# EAGLE schematic ecgdesign (EAGLE 9.2.1)
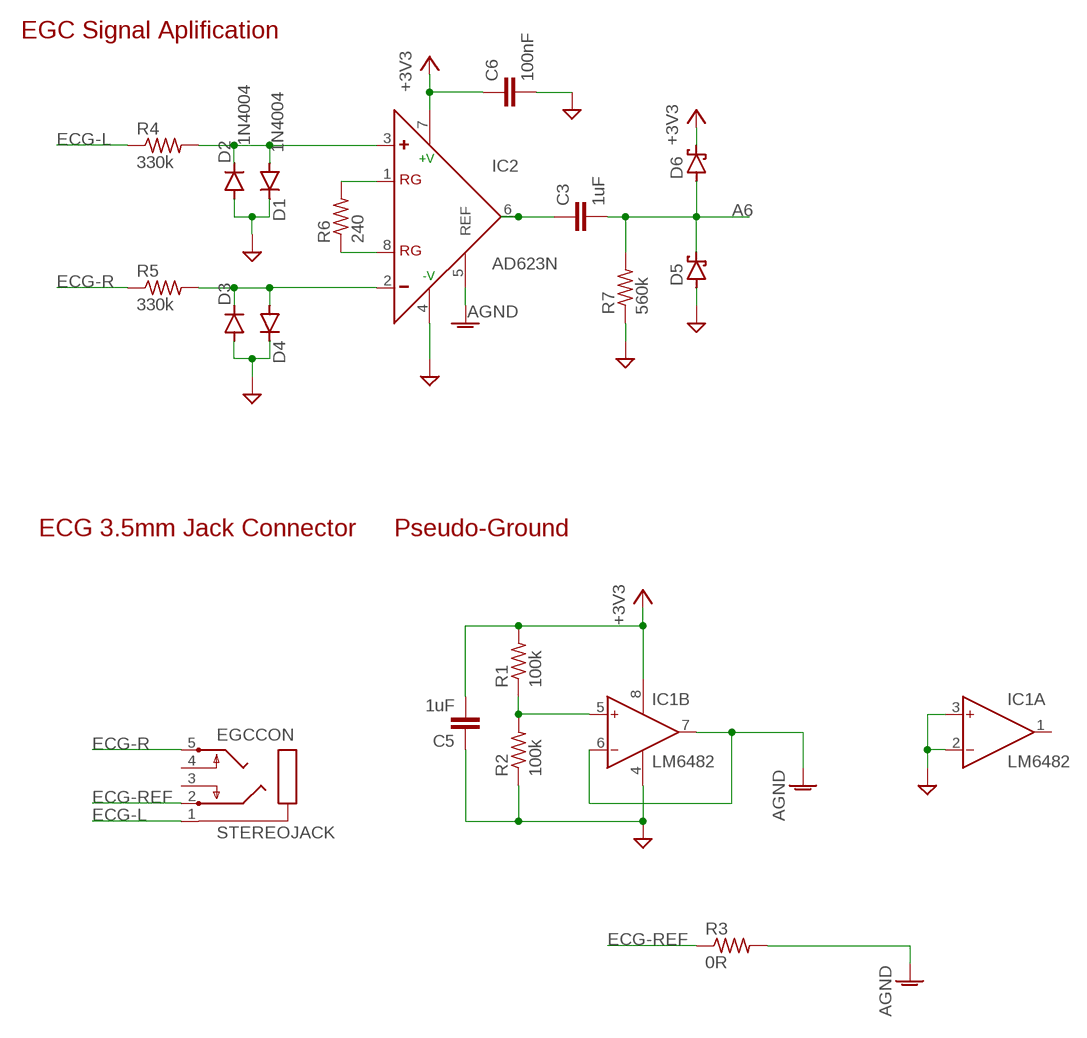
[diagram p0: schematic, sheet 1]

## Parts
C3  1uF  C-EUC0603  [C0603]
C5  1uF  C-EUC0603  [C0603]
C6  100nF  C-EUC0603  [C0603]
D1  1N4004  [DO41-10]
D2  1N4004  [DO41-10]
D3  1N4004  [DO41-10]
D4  1N4004  [DO41-10]
D5  SCHOTTKY-DIODEDO35-7  [DO35-7]
D6  SCHOTTKY-DIODEDO35-7  [DO35-7]
EGCCON  STEREOJACK  [STX3100]
IC1  LM6482  AD826N  [DIL08]
IC2  AD623N  [DIL08]
R1  100k  R-US_R0603  [R0603]
R2  100k  R-US_R0603  [R0603]
R3  0R  R-US_R0603  [R0603]
R4  330k  R-US_R0603  [R0603]
R5  330k  R-US_R0603  [R0603]
R6  240  R-US_R0603  [R0603]
R7  560k  R-US_R0603  [R0603]

## Nets
+3V3 [POWER]: C5.2 C6.1 D6.C IC1.8(P:V+) IC2.7(+V) R1.2
A6: C3.2 D5.C D6.A R7.2
AGND: IC1.6(B:IN-) IC1.7(B:OUT) IC2.5(REF) R3.2
ECG-L: EGCCON.1 R4.1
ECG-R: EGCCON.5 R5.1
ECG-REF: EGCCON.2 R3.1
GND [POWER]: C5.1 C6.2 D1.C D2.A D3.A D4.C D5.A IC1.2(A:IN-) IC1.3(A:IN+) IC1.4(P:V-) IC2.4(-V) R2.1 R7.1
N$2: D3.C D4.A IC2.2(-) R5.2
N$3: IC1.5(B:IN+) R1.1 R2.2
N$5: D1.A D2.C IC2.3(+) R4.2
N$6: C3.1 IC2.6(OUT)
N$7: IC2.8(RG) R6.1
N$8: IC2.1(RG) R6.2
Unconnected: EGCCON.3 EGCCON.4 IC1.1(A:OUT)

## Notes on the sheet
- EGC Signal Aplification
- ECG 3.5mm Jack Connector | Pseudo-Ground

## Library data of the parts
C3 C5 C6 = rcl:C-EU: CAPACITOR, European symbol; SPICEPREFIX: C
D1-D4 = diode:1N4004: DIODE general purpose rectifier, 1 A
D5 D6 = diode:SCHOTTKY-DIODE: Schottky Diode
EGCCON = adafruit:STEREOJACK: MIC/HEADPHONE JACK Stereo jack with two switches. Kycon STX3100, CUI SJ1-3555NG and/or 4UCon 05544
IC1 = analog-devices:AD826: High-Speed, Low-Power Dual Operational Amplifier Source: http://www.analog.com/static/imported-files/data_sheets/AD826.pdf; MF: ALTERA CORPORATION; MPN: AD826ANZ; OC_FARNELL: 1438583; OC_NEWARK: 59K6530
IC2 = analog-devices:AD623: Single-Supply, Rail-to-Rail, Low Cost Instrumentation Amplifier Source: http://www.analog.com/static/imported-files/data_sheets/AD623.pdf; MF: ALTERA CORPORATION; MPN: AD623ANZ; OC_FARNELL: 9603700; OC_NEWARK: 59K4402
R1-R7 = rcl:R-US_: RESISTOR, American symbol; SPICEPREFIX: R

## Net classes
1 POWER: width 0.61 mm